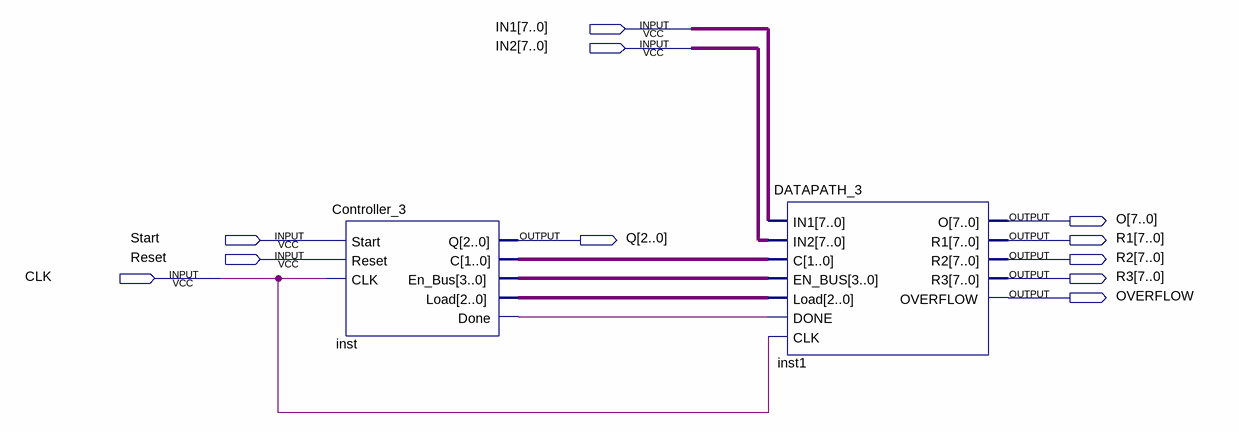
[diagram p0: schematic sheet]
// Quartus schematic Bai3.bdf as structural Verilog: 2 symbols, 11 pins
module Bai3 (
  input  [7:0] IN1,
  input  [7:0] IN2,
  input  Start,
  input  Reset,
  input  CLK,
  output [7:0] O,
  output [2:0] Q,
  output [7:0] R1,
  output [7:0] R2,
  output [7:0] R3,
  output OVERFLOW
);

  wire inst_done;
  wire [1:0] inst_c;
  wire [2:0] inst_load;
  wire [3:0] inst_en_bus;

  Controller_3 inst (
    .Start(Start), .Reset(Reset), .CLK(CLK), .Q(Q), .C(inst_c), .Load(inst_load), .En_Bus(inst_en_bus),
    .Done(inst_done));
  DATAPATH_3 inst1 (
    .IN1(IN1), .IN2(IN2), .C(inst_c), .EN_BUS(inst_en_bus), .Load(inst_load), .DONE(inst_done), .CLK(CLK),
    .O(O), .R1(R1), .R2(R2), .R3(R3), .OVERFLOW(OVERFLOW));
endmodule
